# EAGLE design LogicLab1G (EAGLE 7.6.0)
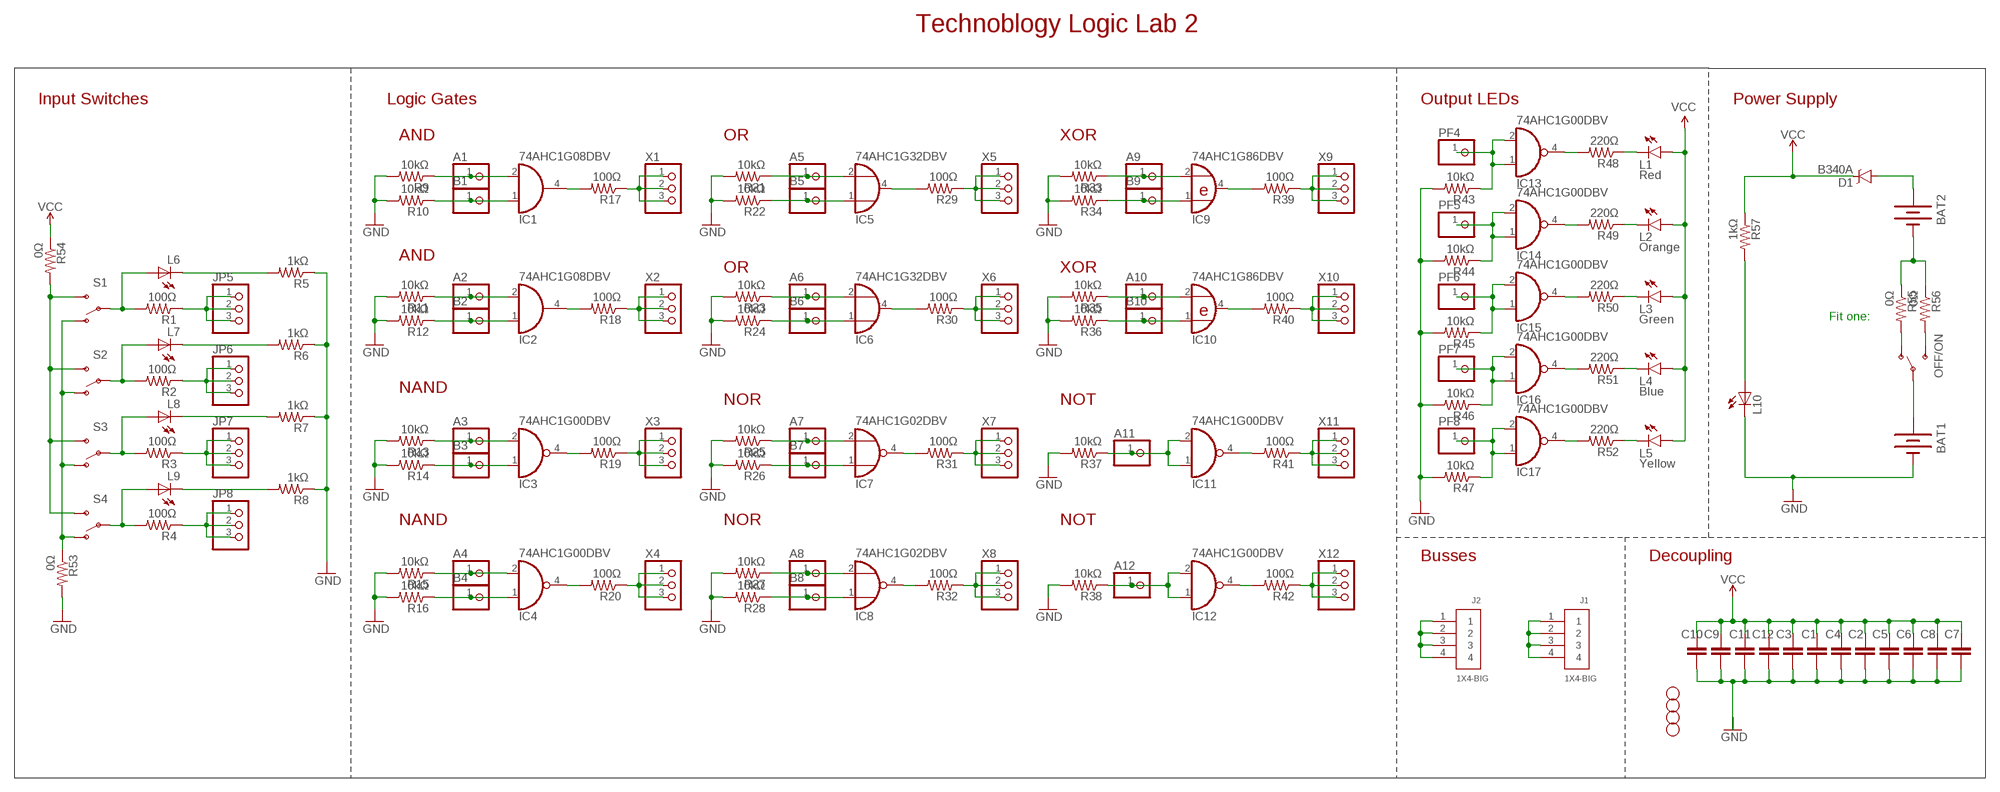
[diagram p0: schematic, sheet 1]

## Parts
A1  PINHD-1X1  [1X01]
A2  PINHD-1X1  [1X01]
A3  PINHD-1X1  [1X01]
A4  PINHD-1X1  [1X01]
A5  PINHD-1X1  [1X01]
A6  PINHD-1X1  [1X01]
A7  PINHD-1X1  [1X01]
A8  PINHD-1X1  [1X01]
A9  PINHD-1X1  [1X01]
A10  PINHD-1X1  [1X01]
A11  PINHD-1X1  [1X01]
A12  PINHD-1X1  [1X01]
B1  PINHD-1X1  [1X01]
B2  PINHD-1X1  [1X01]
B3  PINHD-1X1  [1X01]
B4  PINHD-1X1  [1X01]
B5  PINHD-1X1  [1X01]
B6  PINHD-1X1  [1X01]
B7  PINHD-1X1  [1X01]
B8  PINHD-1X1  [1X01]
B9  PINHD-1X1  [1X01]
B10  PINHD-1X1  [1X01]
BAT1  BATTERYAAA-KIT  [BATTERY-AAA-KIT]
BAT2  BATTERYAAA-KIT  [BATTERY-AAA-KIT]
C1  100n  CAP0805  [0805]
C2  100n  CAP0805  [0805]
C3  100n  CAP0805  [0805]
C4  10uF  CAP0805  [0805]
C5  100n  CAP0805  [0805]
C6  100n  CAP0805  [0805]
C7  100n  CAP0805  [0805]
C8  100n  CAP0805  [0805]
C9  100n  CAP0805  [0805]
C10  100n  CAP0805  [0805]
C11  10uF  CAP0805  [0805]
C12  100n  CAP0805  [0805]
D1  B340A  [SMA-DIODE]
IC1  74AHC1G08DBV  [SOT23-5]
IC2  74AHC1G08DBV  [SOT23-5]
IC3  74AHC1G00DBV  [SOT23-5]
IC4  74AHC1G00DBV  [SOT23-5]
IC5  74AHC1G32DBV  [SOT23-5]
IC6  74AHC1G32DBV  [SOT23-5]
IC7  74AHC1G02DBV  [SOT23-5]
IC8  74AHC1G02DBV  [SOT23-5]
IC9  74AHC1G86DBV  [SOT23-5]
IC10  74AHC1G86DBV  [SOT23-5]
IC11  74AHC1G00DBV  [SOT23-5]
IC12  74AHC1G00DBV  [SOT23-5]
IC13  74AHC1G00DBV  [SOT23-5]
IC14  74AHC1G00DBV  [SOT23-5]
IC15  74AHC1G00DBV  [SOT23-5]
IC16  74AHC1G00DBV  [SOT23-5]
IC17  74AHC1G00DBV  [SOT23-5]
J1  1X4-BIG  [1X04-BIG]
J2  1X4-BIG  [1X04-BIG]
JP1  STAND-OFF  [STAND-OFF]
JP2  STAND-OFF  [STAND-OFF]
JP3  STAND-OFF  [STAND-OFF]
JP4  STAND-OFF  [STAND-OFF]
JP5  PINHD-1X3  [1X03]
JP6  PINHD-1X3  [1X03]
JP7  PINHD-1X3  [1X03]
JP8  PINHD-1X3  [1X03]
L1  Red  LED5MM  [LED5MM]
L2  Orange  LED5MM  [LED5MM]
L3  Green  LED5MM  [LED5MM]
L4  Blue  LED5MM  [LED5MM]
L5  Yellow  LED5MM  [LED5MM]
L6  LEDCHIPLED_0805  [CHIPLED_0805]
L7  LEDCHIPLED_0805  [CHIPLED_0805]
L8  LEDCHIPLED_0805  [CHIPLED_0805]
L9  LEDCHIPLED_0805  [CHIPLED_0805]
L10  LEDCHIPLED_0805  [CHIPLED_0805]
OFF/ON  SWITCH-SPDTKIT  [SWITCH-SPDT_KIT]
PF4  PINHD-1X1  [1X01]
PF5  PINHD-1X1  [1X01]
PF6  PINHD-1X1  [1X01]
PF7  PINHD-1X1  [1X01]
PF8  PINHD-1X1  [1X01]
R1  100Ω  RESISTOR0805-RES  [0805]
R2  100Ω  RESISTOR0805-RES  [0805]
R3  100Ω  RESISTOR0805-RES  [0805]
R4  100Ω  RESISTOR0805-RES  [0805]
R5  1kΩ  RESISTOR0805-RES  [0805]
R6  1kΩ  RESISTOR0805-RES  [0805]
R7  1kΩ  RESISTOR0805-RES  [0805]
R8  1kΩ  RESISTOR0805-RES  [0805]
R9  10kΩ  RESISTOR0805-RES  [0805]
R10  10kΩ  RESISTOR0805-RES  [0805]
R11  10kΩ  RESISTOR0805-RES  [0805]
R12  10kΩ  RESISTOR0805-RES  [0805]
R13  10kΩ  RESISTOR0805-RES  [0805]
R14  10kΩ  RESISTOR0805-RES  [0805]
R15  10kΩ  RESISTOR0805-RES  [0805]
R16  10kΩ  RESISTOR0805-RES  [0805]
R17  100Ω  RESISTOR0805-RES  [0805]
R18  100Ω  RESISTOR0805-RES  [0805]
R19  100Ω  RESISTOR0805-RES  [0805]
R20  100Ω  RESISTOR0805-RES  [0805]
R21  10kΩ  RESISTOR0805-RES  [0805]
R22  10kΩ  RESISTOR0805-RES  [0805]
R23  10kΩ  RESISTOR0805-RES  [0805]
R24  10kΩ  RESISTOR0805-RES  [0805]
R25  10kΩ  RESISTOR0805-RES  [0805]
R26  10kΩ  RESISTOR0805-RES  [0805]
R27  10kΩ  RESISTOR0805-RES  [0805]
R28  10kΩ  RESISTOR0805-RES  [0805]
R29  100Ω  RESISTOR0805-RES  [0805]
R30  100Ω  RESISTOR0805-RES  [0805]
R31  100Ω  RESISTOR0805-RES  [0805]
R32  100Ω  RESISTOR0805-RES  [0805]
R33  10kΩ  RESISTOR0805-RES  [0805]
R34  10kΩ  RESISTOR0805-RES  [0805]
R35  10kΩ  RESISTOR0805-RES  [0805]
R36  10kΩ  RESISTOR0805-RES  [0805]
R37  10kΩ  RESISTOR0805-RES  [0805]
R38  10kΩ  RESISTOR0805-RES  [0805]
R39  100Ω  RESISTOR0805-RES  [0805]
R40  100Ω  RESISTOR0805-RES  [0805]
R41  100Ω  RESISTOR0805-RES  [0805]
R42  100Ω  RESISTOR0805-RES  [0805]
R43  10kΩ  RESISTOR0805-RES  [0805]
R44  10kΩ  RESISTOR0805-RES  [0805]
R45  10kΩ  RESISTOR0805-RES  [0805]
R46  10kΩ  RESISTOR0805-RES  [0805]
R47  10kΩ  RESISTOR0805-RES  [0805]
R48  220Ω  RESISTOR0805-RES  [0805]
R49  220Ω  RESISTOR0805-RES  [0805]
R50  220Ω  RESISTOR0805-RES  [0805]
R51  220Ω  RESISTOR0805-RES  [0805]
R52  220Ω  RESISTOR0805-RES  [0805]
R53  0Ω  RESISTOR0805-RES  [0805]
R54  0Ω  RESISTOR0805-RES  [0805]
R55  0Ω  RESISTOR0805-RES  [0805]
R56  0Ω  RESISTOR0805-RES  [0805]
R57  1kΩ  RESISTOR0805-RES  [0805]
S1  SWITCH-SPDTKIT  [SWITCH-SPDT_KIT]
S2  SWITCH-SPDTKIT  [SWITCH-SPDT_KIT]
S3  SWITCH-SPDTKIT  [SWITCH-SPDT_KIT]
S4  SWITCH-SPDTKIT  [SWITCH-SPDT_KIT]
X1  PINHD-1X3  [1X03]
X2  PINHD-1X3  [1X03]
X3  PINHD-1X3  [1X03]
X4  PINHD-1X3  [1X03]
X5  PINHD-1X3  [1X03]
X6  PINHD-1X3  [1X03]
X7  PINHD-1X3  [1X03]
X8  PINHD-1X3  [1X03]
X9  PINHD-1X3  [1X03]
X10  PINHD-1X3  [1X03]
X11  PINHD-1X3  [1X03]
X12  PINHD-1X3  [1X03]

## Nets
BOTTOMS: R53.1 S1.1(O) S2.1(O) S3.1(O) S4.1(O)
GND: BAT1.GND@1(-) C1.2 C2.2 C3.2 C4.2 C5.2 C6.2 C7.2 C8.2 C9.2 C10.2 C11.2 C12.2 L10.C R5.1 R6.1 R7.1 R8.1 R9.2 R10.2 R11.2 R12.2 R13.2 R14.2 R15.2 R16.2 R21.2 R22.2 R23.2 R24.2 R25.2 R26.2 R27.2 R28.2 R33.2 R34.2 R35.2 R36.2 R37.2 R38.2 R43.2 R44.2 R45.2 R46.2 R47.2 R53.2
N$1: A9.1 IC9.2(I1) R33.1
N$6: R30.1 X6.1 X6.2 X6.3
N$7: R29.1 X5.1 X5.2 X5.3
N$8: B4.1 IC4.1(I0) R16.1
N$9: IC13.4(O) R48.2
N$10: IC14.4(O) R49.2
N$11: IC15.4(O) R50.2
N$12: BAT1.PWR@1(+) OFF/ON.2(P)
N$13: B10.1 IC10.1(I0) R36.1
N$14: IC16.4(O) R51.2
N$15: A4.1 IC4.2(I1) R15.1
N$16: IC17.4(O) R52.2
N$17: BAT2.PWR@1(+) D1.A
N$18: R39.1 X9.1 X9.2 X9.3
N$19: IC2.4(O) R18.2
N$20: OFF/ON.1(O) R55.2
N$21: R40.1 X10.1 X10.2 X10.3
N$22: A1.1 IC1.2(I1) R9.1
N$23: IC5.4(O) R29.2
N$24: BAT2.GND@1(-) R55.1 R56.1
N$25: L1.K(C) R48.1
N$26: B3.1 IC3.1(I0) R14.1
N$27: B1.1 IC1.1(I0) R10.1
N$28: B7.1 IC7.1(I0) R26.1
N$29: B9.1 IC9.1(I0) R34.1
N$30: R17.1 X1.1 X1.2 X1.3
N$31: R41.1 X11.1 X11.2 X11.3
N$32: OFF/ON.3(S) R56.2
N$33: R18.1 X2.1 X2.2 X2.3
N$34: B2.1 IC2.1(I0) R12.1
N$35: A10.1 IC10.2(I1) R35.1
N$36: R42.1 X12.1 X12.2 X12.3
N$38: L6.A R1.2 S1.2(P)
N$39: R19.1 X3.1 X3.2 X3.3
N$40: A8.1 IC8.2(I1) R27.1
N$41: R31.1 X7.1 X7.2 X7.3
N$42: B5.1 IC5.1(I0) R22.1
N$43: L7.A R2.2 S2.2(P)
N$44: A5.1 IC5.2(I1) R21.1
N$45: IC3.4(O) R19.2
N$46: IC9.4(O) R39.2
N$47: IC10.4(O) R40.2
N$48: IC12.4(O) R42.2
N$49: IC11.4(O) R41.2
N$50: R32.1 X8.1 X8.2 X8.3
N$51: A11.1 IC11.1(I0) IC11.2(I1) R37.1
N$52: A12.1 IC12.1(I0) IC12.2(I1) R38.1
N$53: L2.K(C) R49.1
N$54: IC6.4(O) R30.2
N$56: L8.A R3.2 S3.2(P)
N$57: L9.A R4.2 S4.2(P)
N$58: IC4.4(O) R20.2
N$61: R20.1 X4.1 X4.2 X4.3
N$62: L3.K(C) R50.1
N$63: L4.K(C) R51.1
N$64: L5.K(C) R52.1
N$65: IC13.1(I0) IC13.2(I1) PF4.1 R43.1
N$66: IC14.1(I0) IC14.2(I1) PF5.1 R44.1
N$68: JP8.1 JP8.2 JP8.3 R4.1
N$69: JP7.1 JP7.2 JP7.3 R3.1
N$70: L10.A R57.2
N$71: J2.1 J2.2 J2.3 J2.4
N$72: JP6.1 JP6.2 JP6.3 R2.1
N$73: L9.C R8.2
N$74: L8.C R7.2
N$75: JP5.1 JP5.2 JP5.3 R1.1
N$76: L6.C R5.2
N$77: L7.C R6.2
N$78: B8.1 IC8.1(I0) R28.1
N$79: J1.1 J1.2 J1.3 J1.4
N$82: A6.1 IC6.2(I1) R23.1
N$85: IC15.1(I0) IC15.2(I1) PF6.1 R45.1
N$86: B6.1 IC6.1(I0) R24.1
N$87: A7.1 IC7.2(I1) R25.1
N$89: A3.1 IC3.2(I1) R13.1
N$90: A2.1 IC2.2(I1) R11.1
N$97: IC8.4(O) R32.2
N$98: IC7.4(O) R31.2
N$99: IC16.1(I0) IC16.2(I1) PF7.1 R46.1
N$101: IC17.1(I0) IC17.2(I1) PF8.1 R47.1
N$102: IC1.4(O) R17.2
TOPS: R54.2 S1.3(S) S2.3(S) S3.3(S) S4.3(S)
VCC: C1.1 C2.1 C3.1 C4.1 C5.1 C6.1 C7.1 C8.1 C9.1 C10.1 C11.1 C12.1 D1.C L1.A L2.A L3.A L4.A L5.A R54.1 R57.1

## Notes on the sheet
- Technoblogy Logic Lab 2
- Input Switches | Logic Gates | Output LEDs | Power Supply
- AND | OR | XOR
- AND
- OR | XOR
- Fit one:
- NAND
- NOR | NOT
- NAND | NOR | NOT
- Busses | Decoupling

## Power pins joined to a net without a drawn wire
GND: IC1.3(GND) IC2.3(GND) IC3.3(GND) IC4.3(GND) IC5.3(GND) IC6.3(GND) IC7.3(GND) IC8.3(GND) IC9.3(GND) IC10.3(GND) IC11.3(GND) IC12.3(GND) IC13.3(GND) IC14.3(GND) IC15.3(GND) IC16.3(GND) IC17.3(GND)
VCC: IC1.5(VCC) IC2.5(VCC) IC3.5(VCC) IC4.5(VCC) IC5.5(VCC) IC6.5(VCC) IC7.5(VCC) IC8.5(VCC) IC9.5(VCC) IC10.5(VCC) IC11.5(VCC) IC12.5(VCC) IC13.5(VCC) IC14.5(VCC) IC15.5(VCC) IC16.5(VCC) IC17.5(VCC)

## Library data of the parts
A1-A12 B1-B10 PF4-PF8 = adafruit:PINHD-1X1: Pin header 1x1 for 0.1" spacing With round pins
BAT1 BAT2 = SparkFun-Electromechanical:BATTERY: Battery Holders Various common sizes : AA, AAA, 18650 (PRT-12895), 20mm coin cell and 12mm coin cell. 20MM_4LEGS, BATT-10373; PROD_ID: BATT-08571
C1-C12 = SparkFun-Capacitors:CAP: Capacitor Standard 0603 ceramic capacitor, and 0.1" leaded capacitor.
D1 = SparkFun-DiscreteSemi:B340A: Schottky Diode 3A-40V; PROD_ID: DIO-09886; VALUE: BA340A
IC1 IC2 = 74xx-little-de:74*1G08: 2-input AND gate
IC3 IC4 IC11-IC17 = 74xx-little-de:74*1G00: 2-input NAND gate
IC5 IC6 = 74xx-little-de:74*1G32: 2-input OR gate
IC7 IC8 = 74xx-little-de:74*1G02: 2-input NOR gate
IC9 IC10 = 74xx-little-de:74*1G86: 2-input EXCLUSIV-OR gate
J1 J2 = adafruit:1X4: 4-pin connector
JP1-JP4 = SparkFun:STAND-OFF: Stand Off This is the mechanical footprint for a #4 phillips button head screw. Use the keepout ring to avoid running the screw head into surrounding components. SKU : PRT-00447
JP5-JP8 X1-X12 = adafruit:PINHD-1X3: PIN HEADER
L1-L5 = SparkFun-LED:LED: LEDs Standard schematic elements and footprints for 5mm, 3mm, 1206, and 0603 sized LEDs. 5mm - Spark Fun Electronics SKU : COM-00529 (and others)
L6-L10 = adafruit:LED: LED OSRAM: - CHIPLED LG R971, LG N971, LY N971, LG Q971, LY Q971, LO R971, LY R971 LH N974, LH R974 LS Q976, LO Q976, LY Q976 LO Q996 - Hyper CHIPLED LW Q18S LB Q993, LB Q99A, LB R99A - SideLED LS A670, LO A670, LY A670, LG A670, LP A670 LB A673, LV A673, LT A673, LW A673 LH A674 LY A675 LS A676, LA A676, LO A676, LY A676, LW A676 LS A679, LY A679, LG A679 - Hyper Micro SIDELED® LS Y876, LA Y876, LO Y876, LY Y876 LT Y87S - SmartLED LW L88C, LW L88S LB L89C, LB L89S, LG L890 LS L89K, LO L89K, LY L89K LS L896, LA L896, LO L896, LY L896 - TOPLED LS T670, LO T670, LY T670, LG T670, LP T670 LSG T670, LSP T670, LSY T670, LOP T670, LYG T670 LG T671, LOG T671, LSG T671 LB T673, LV T673, LT T673, LW T673 LH T674 LS T676, LA T676, LO T676, LY T676, LB T676, LH T676, LSB T676, LW T676 LB T67C, LV T67C, LT T67C, LS T67K, LO T67K, LY T67K, LW E67C LS E67B, LA E67B, LO E67B, LY E67B, LB E67C, LV E67C, LT E67C LW T67C LS T679, LY T679, LG T679 LS T770, LO T770, LY T770, LG T770, LP T770 LB T773, LV T773, LT T773, LW T773 LH T774 LS E675, LA E675, LY E675, LS T675 LS T776, LA T776, LO T776, LY T776, LB T776 LHGB T686 LT T68C, LB T68C - Hyper Mini TOPLED® LB M676 - Mini TOPLED Santana® LG M470 LS M47K, LO M47K, LY M47K Source: http://www.osram.convergy.de/
OFF/ON S1-S4 = technoblogy:SWITCH-SPDT: SPDT Switch Simple slide switch, Spark Fun Electronics SKU : COM-00102 DPDT SMT slide switch, AYZ0202, SWCH-08179; PROD_ID: SWCH-08261
R1-R57 = SparkFun-Resistors:RESISTOR: Resistor Basic schematic elements and footprints for 0603, 1206, and PTH resistors.

## Net classes
0 default: width 0.152 mm, drill 0.305 mm, clearance 0.152 mm

## Board
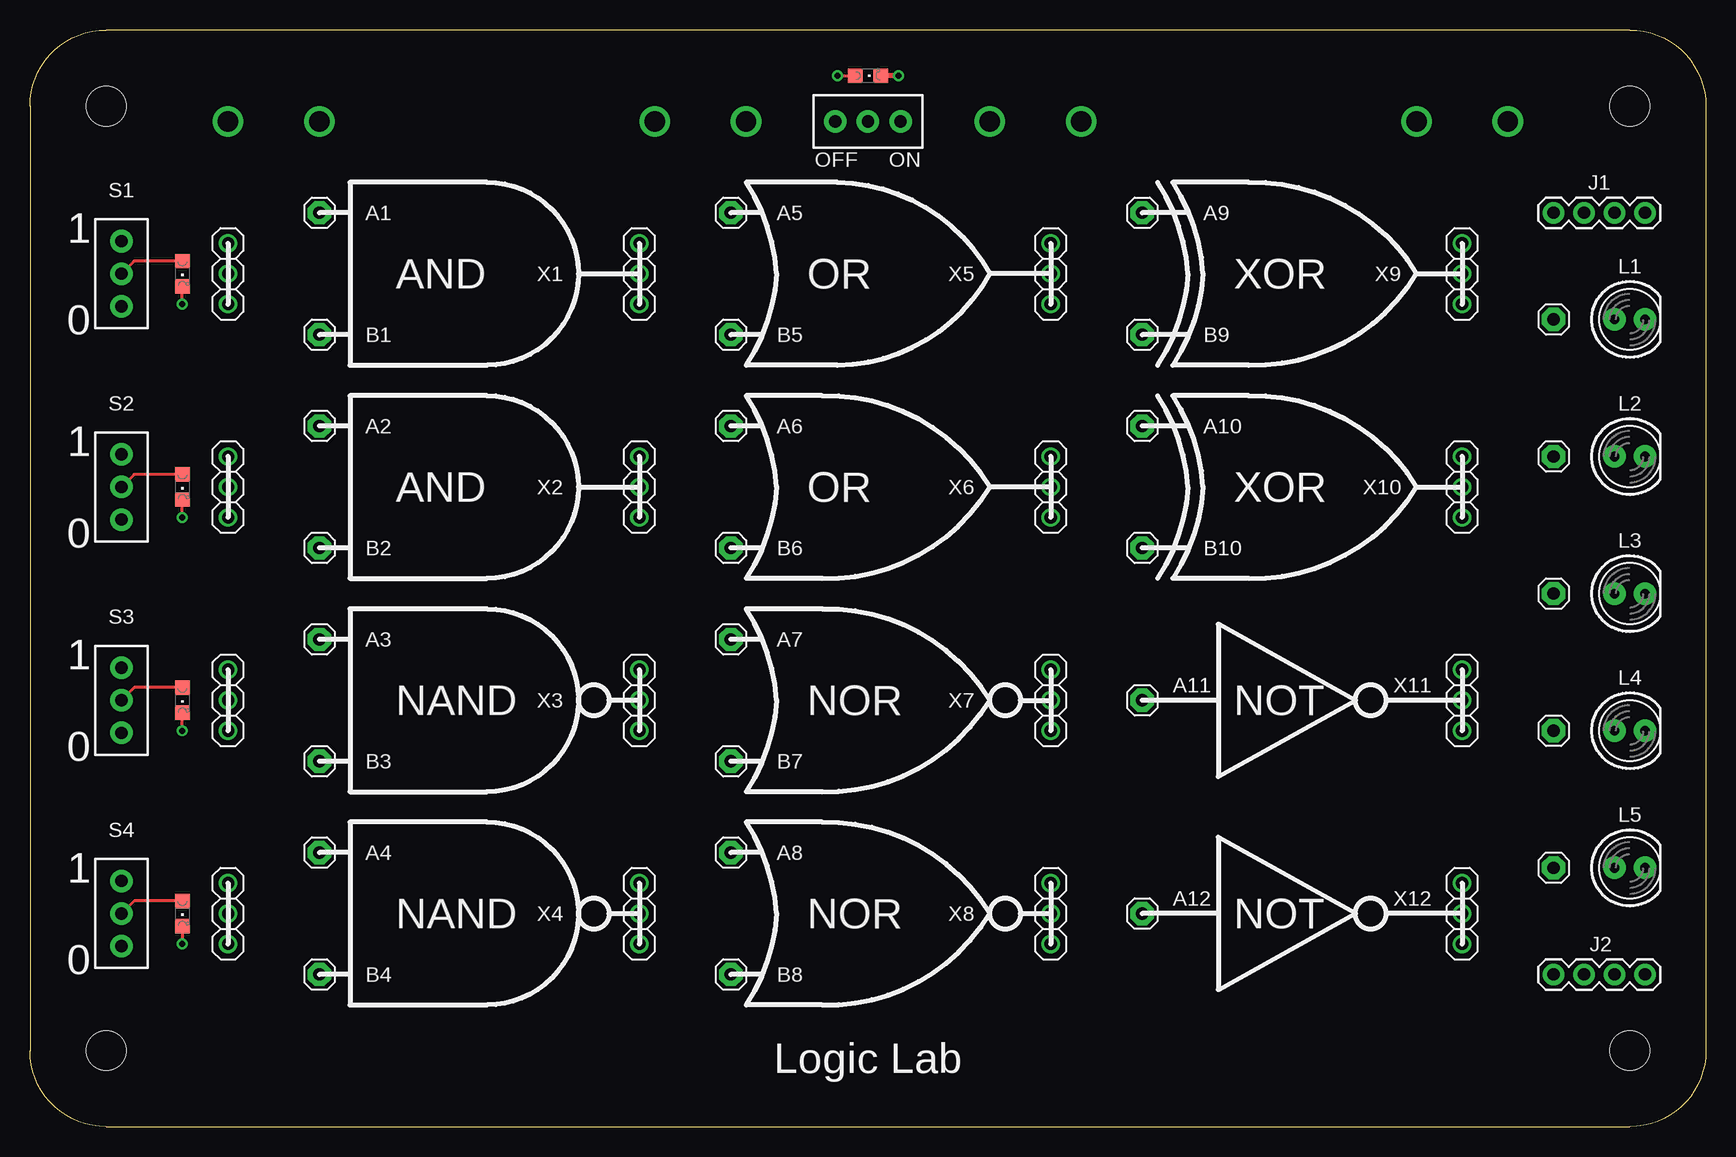
[diagram p1: board, top side]
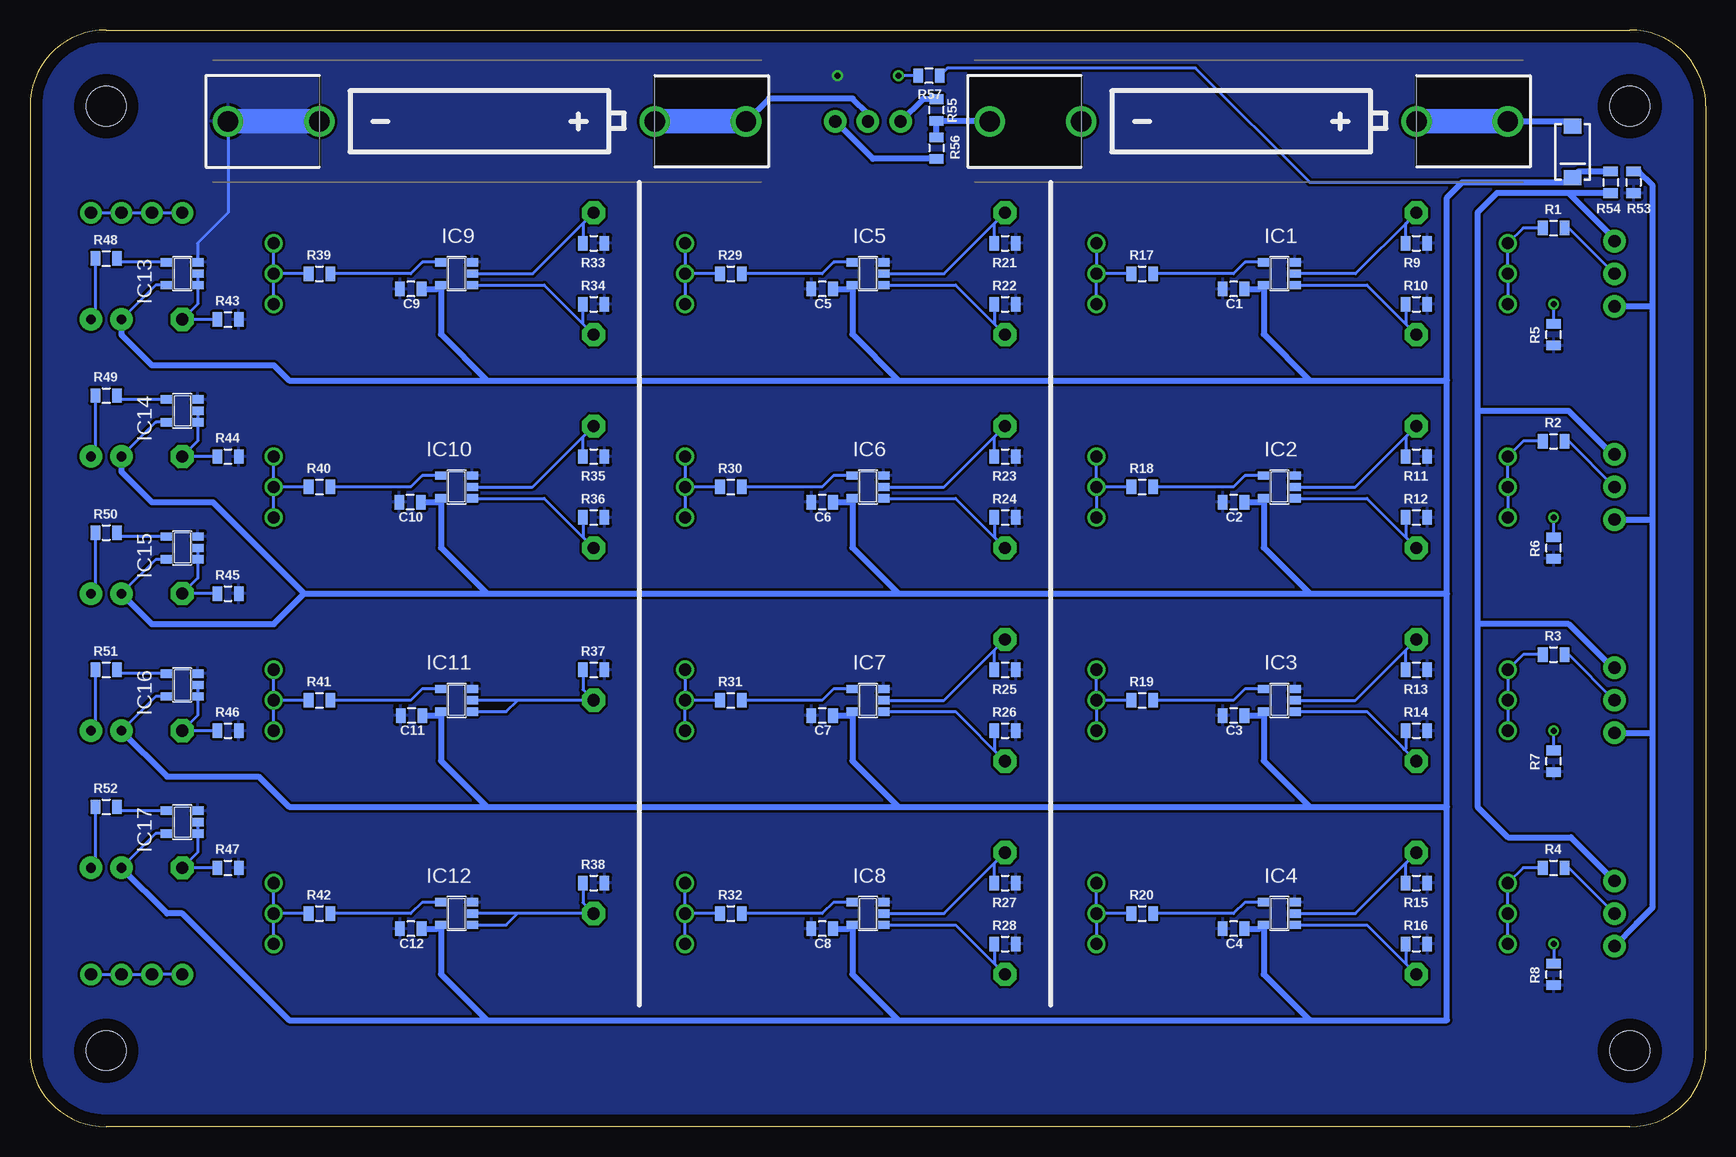
[diagram p2: board, bottom side, seen from below]

Size 139.7 x 91.44 mm. Coordinates in mm from the lower left corner, seen from the top.
Outline: 6.35,0 133.35,0 arc90 139.7,6.35 139.7,85.09 arc90 133.35,91.44 6.35,91.44 arc90 0,85.09 0,6.35 arc90 6.35,0
Copper layers (1*16): Top 0.035mm / dielectric 1.5mm / Bottom 0.035mm
Design rules "default *": minimum track width 10mil, minimum drill 24mil, track to track 8mil, track to pad 8mil, pad to pad 8mil, via to via 8mil, smd to smd 8mil, copper to edge 40mil, drill to drill 8mil, minimum pad ring 10mil, minimum via ring 8mil, stop-mask expansion 4mil, vias tented up to drill 20mil, thermal gap 10mil

### Footprints (pad centres in the part's own frame; a part is rotated, then mirrored left to right if it is on the bottom)
1X01 = drill 1.016 pad 1.93 octagon: 1 0,0
BATTERY-AAA-KIT = drill 1.702: GND@1 21.59,0; GND@2 13.97,0; PWR@1 -21.59,0; PWR@2 -13.97,0
0805 = smd 0.8 x 1.2: 1 -0.9,0; 2 0.9,0
SMA-DIODE = smd 1.27 x 1.47: A -2.15,0; C 2.15,0
SOT23-5 = smd 0.69 x 0.99: 1 -0.95,-1.29; 2 0,-1.29; 3 0.95,-1.29; 4 0.95,1.3; 5 -0.95,1.3
1X04-BIG = drill 1.016 pad 1.778: 1 0,0; 2 2.54,0; 3 5.08,0; 4 7.62,0
STAND-OFF = hole 3.302: 0,0
1X03 = drill 1.016: 1 -2.54,0; 2 0,0; 3 2.54,0
LED5MM = drill 0.813 pad 1.88: A -1.27,0; K 1.27,0
CHIPLED_0805 = smd 1.2 x 1.2: A 0,-1.05; C 0,1.05
SWITCH-SPDT_KIT = drill 1.016 pad 1.88: 1 0,2.718; 2 0,0; 3 0,-2.718

### Placement (x,y rotation side)
A1  24.13,76.2 0 top
A2  24.13,58.42 0 top
A3  24.13,40.64 0 top
A4  24.13,22.86 0 top
A5  58.42,76.2 0 top
A6  58.42,58.42 0 top
A7  58.42,40.64 0 top
A8  58.42,22.86 0 top
A9  92.71,76.2 0 top
A10  92.71,58.42 0 top
A11  92.71,35.56 0 top
A12  92.71,17.78 0 top
B1  24.13,66.04 0 top
B2  24.13,48.26 0 top
B3  24.13,30.48 0 top
B4  24.13,12.7 0 top
B5  58.42,66.04 0 top
B6  58.42,48.26 0 top
B7  58.42,30.48 0 top
B8  58.42,12.7 0 top
B9  92.71,66.04 0 top
B10  92.71,48.26 0 top
BAT1  101.6,83.82 180 bottom
BAT2  38.1,83.82 180 bottom
C1  39.37,69.85 180 bottom
C2  39.37,52.07 180 bottom
C3  39.37,34.29 180 bottom
C4  39.37,16.51 180 bottom
C5  73.66,69.85 180 bottom
C6  73.66,52.07 180 bottom
C7  73.66,34.29 180 bottom
C8  73.66,16.51 180 bottom
C9  107.95,69.85 180 bottom
C10  108.01,52.07 180 bottom
C11  107.89,34.29 180 bottom
C12  107.95,16.51 180 bottom
D1  11.11,81.28 270 bottom
IC1  35.56,71.12 90 bottom
IC2  35.56,53.34 90 bottom
IC3  35.56,35.56 90 bottom
IC4  35.56,17.78 90 bottom
IC5  69.85,71.12 90 bottom
IC6  69.85,53.34 90 bottom
IC7  69.85,35.56 90 bottom
IC8  69.85,17.78 90 bottom
IC9  104.14,71.12 90 bottom
IC10  104.14,53.34 90 bottom
IC11  104.14,35.56 90 bottom
IC12  104.14,17.78 90 bottom
IC13  127,71.12 90 bottom
IC14  127,59.69 90 bottom
IC15  127,48.26 90 bottom
IC16  127,36.83 90 bottom
IC17  127,25.4 90 bottom
J1  127,76.2 0 top
J2  127,12.7 0 top
JP1  6.35,85.09 0 top
JP2  6.35,6.35 0 top
JP3  133.35,6.35 0 top
JP4  133.35,85.09 0 top
JP5  16.51,71.12 90 top
JP6  16.51,53.34 90 top
JP7  16.51,35.56 90 top
JP8  16.51,17.78 90 top
L1  133.35,67.31 0 top
L2  133.35,55.88 0 top
L3  133.35,44.45 0 top
L4  133.35,33.02 0 top
L5  133.35,21.59 0 top
L6  12.7,71.12 180 top
L7  12.7,53.34 180 top
L8  12.7,35.56 180 top
L9  12.7,17.78 180 top
L10  69.85,87.63 270 top
OFF/ON  69.85,83.82 90 top
PF4  127,67.31 0 top
PF5  127,55.88 0 top
PF6  127,44.45 0 top
PF7  127,33.02 0 top
PF8  127,21.59 0 top
R1  12.7,74.93 0 bottom
R2  12.7,57.15 0 bottom
R3  12.7,39.37 0 bottom
R4  12.7,21.59 0 bottom
R5  12.7,66.04 90 bottom
R6  12.7,48.26 90 bottom
R7  12.7,30.48 90 bottom
R8  12.7,12.7 90 bottom
R9  24.13,73.66 0 bottom
R10  24.13,68.58 0 bottom
R11  24.13,55.88 0 bottom
R12  24.13,50.8 0 bottom
R13  24.13,38.1 0 bottom
R14  24.13,33.02 0 bottom
R15  24.13,20.32 0 bottom
R16  24.13,15.24 0 bottom
R17  46.99,71.12 0 bottom
R18  46.99,53.34 0 bottom
R19  46.99,35.56 0 bottom
R20  46.99,17.78 0 bottom
R21  58.42,73.66 0 bottom
R22  58.42,68.58 0 bottom
R23  58.42,55.88 0 bottom
R24  58.42,50.8 0 bottom
R25  58.42,38.1 0 bottom
R26  58.42,33.02 0 bottom
R27  58.42,20.32 0 bottom
R28  58.42,15.24 0 bottom
R29  81.28,71.12 0 bottom
R30  81.28,53.34 0 bottom
R31  81.28,35.56 0 bottom
R32  81.28,17.78 0 bottom
R33  92.71,73.66 0 bottom
R34  92.71,68.58 0 bottom
R35  92.71,55.88 0 bottom
R36  92.71,50.8 0 bottom
R37  92.71,38.1 0 bottom
R38  92.71,20.32 0 bottom
R39  115.57,71.12 0 bottom
R40  115.57,53.34 0 bottom
R41  115.57,35.56 0 bottom
R42  115.57,17.78 0 bottom
R43  123.19,67.31 0 bottom
R44  123.19,55.88 0 bottom
R45  123.19,44.45 0 bottom
R46  123.19,33.02 0 bottom
R47  123.19,21.59 0 bottom
R48  133.35,72.39 0 bottom
R49  133.35,60.96 0 bottom
R50  133.35,49.53 0 bottom
R51  133.35,38.1 0 bottom
R52  133.35,26.67 0 bottom
R53  6.03,78.74 270 bottom
R54  7.94,78.74 270 bottom
R55  64.14,84.77 90 bottom
R56  64.14,81.6 270 bottom
R57  64.77,87.63 180 bottom
S1  7.62,71.12 180 top
S2  7.62,53.34 180 top
S3  7.62,35.56 180 top
S4  7.62,17.78 180 top
X1  50.8,71.12 90 top
X2  50.8,53.34 90 top
X3  50.8,35.56 90 top
X4  50.8,17.78 90 top
X5  85.09,71.12 90 top
X6  85.09,53.34 90 top
X7  85.09,35.56 90 top
X8  85.09,17.78 90 top
X9  119.38,71.12 90 top
X10  119.38,53.34 90 top
X11  119.38,35.56 90 top
X12  119.38,17.78 90 top

### Tracks (layer width: path | path; a pad name or v marks a point on that pad's centre or on a via)
BOTTOMS
  Bottom 0.508: S4.1 5.77,16.97 4.45,18.29 4.45,33.02 | 4.45,33.02 4.45,50.8 | 4.45,50.8 4.45,68.58 | 4.45,68.58 4.45,78.49 5.59,79.63 6.34,79.63 R53.1 | S1.1 4.62,68.4 4.45,68.58 | S2.1 4.62,50.62 4.45,50.8 | S3.1 4.62,32.84 4.45,33.02
GND  (via drill 0.5)
  Top 0.406: v72.39,87.63 L10.C
  Bottom 0.254: BAT1.GND@1 123.19,76.2 125.73,73.66 125.73,72.09 IC13.3
  Bottom 2.032: 115.57,83.82 BAT1.GND@1
  pour Bottom: 0,91.44 139.7,91.44 139.7,0 0,0
N$1
  Bottom 0.254: R33.1 93.61,75.3 A9.1 97.79,71.12 IC9.2
N$6
  Bottom 0.254: X6.3 X6.2 | X6.2 X6.1 | R30.1 X6.2
N$7
  Bottom 0.254: X5.3 X5.2 | X5.2 X5.1 | R29.1 X5.2
N$8
  Bottom 0.254: R16.1 25.03,13.6 B4.1 28.26,16.83 IC4.1
N$9
  Bottom 0.254: IC13.4 132.13,72.07 R48.2
N$10
  Bottom 0.254: IC14.4 132.13,60.64 R49.2
N$11
  Bottom 0.254: IC15.4 132.13,49.21 R50.2
N$12
  Bottom 0.508: OFF/ON.2 69.85,84.45 71.12,85.72 78.11,85.72 BAT1.PWR@1
N$13
  Bottom 0.254: R36.1 93.61,49.16 B10.1 96.84,52.39 IC10.1
N$14
  Bottom 0.254: IC16.4 132.13,37.78 R51.2
N$15
  Bottom 0.254: R15.1 25.03,21.96 A4.1 29.21,17.78 IC4.2
N$16
  Bottom 0.254: IC17.4 132.13,26.35 R52.2
N$17
  Bottom 0.508: BAT2.PWR@1 11.5,83.82 D1.A
  Bottom 1.016: BAT2.PWR@1
N$18
  Bottom 0.254: X9.1 X9.2 | X9.2 X9.3 | R39.1 X9.2
N$19
  Bottom 0.254: IC2.4 38.42,54.29 39.37,53.34 R18.2
N$20
  Bottom 0.508: R55.2 65.28,85.67 OFF/ON.1
N$21
  Bottom 0.254: X10.1 X10.2 | X10.2 X10.3 | R40.1 X10.2
N$22
  Bottom 0.254: A1.1 24.77,75.56 | R9.1 25.03,75.31 24.77,75.56 | 24.77,75.56 29.21,71.12 IC1.2
N$23
  Bottom 0.254: IC5.4 72.71,72.07 73.66,71.12 R29.2
N$24
  Bottom 0.508: R56.1 R55.1 64.14,83.82 BAT2.GND@1
N$25
  Bottom 0.254: R48.1 134.25,67.68 L1.K
N$26
  Bottom 0.254: 25.08,31.43 25.4,31.75 28.26,34.61 IC3.1 | 25.08,31.43 B3.1 | R14.1 25.03,31.48 25.08,31.43
N$27
  Bottom 0.254: R10.1 25.03,66.94 B1.1 28.26,70.17 IC1.1
N$28
  Bottom 0.254: R26.1 59.32,31.38 B7.1 62.55,34.61 IC7.1
N$29
  Bottom 0.254: R34.1 93.61,66.94 B9.1 96.84,70.17 IC9.1
N$30
  Bottom 0.254: R17.1 X1.2 | X1.3 X1.2 | X1.1 X1.2
N$31
  Bottom 0.254: X11.1 X11.2 | X11.2 X11.3 | R41.1 X11.2
N$32
  Bottom 0.508: R56.2 69.44,80.7 OFF/ON.3
N$33
  Bottom 0.254: R18.1 X2.2 | X2.2 X2.3 | X2.2 X2.1
N$34
  Bottom 0.254: R12.1 25.03,49.16 B2.1 28.26,52.39 IC2.1
N$35
  Bottom 0.254: R35.1 93.61,57.52 A10.1 97.79,53.34 IC10.2
N$36
  Bottom 0.254: X12.1 X12.2 | X12.2 X12.3 | R42.1 X12.2
N$38
  Top 0.254: L6.A 8.67,72.17 S1.2
  Bottom 0.254: R1.2 11.43,74.93 S1.2
N$39
  Bottom 0.254: R19.1 X3.2 | X3.2 X3.3 | X3.2 X3.1
N$40
  Bottom 0.254: R27.1 59.32,21.96 A8.1 63.5,17.78 IC8.2
N$41
  Bottom 0.254: X7.3 X7.2 | X7.1 X7.2 | R31.1 X7.2
N$42
  Bottom 0.254: B5.1 58.67,66.04 | R22.1 59.32,66.94 B5.1 | IC5.1 62.55,70.17 B5.1
N$43
  Top 0.254: L7.A 8.67,54.39 S2.2
  Bottom 0.254: R2.2 11.43,57.15 S2.2
N$44
  Bottom 0.254: R21.1 59.32,75.3 A5.1 63.5,71.12 IC5.2
N$45
  Bottom 0.254: R19.2 39.37,35.56 38.42,36.51 IC3.4
N$46
  Bottom 0.254: IC9.4 107,72.07 107.95,71.12 R39.2
N$47
  Bottom 0.254: IC10.4 107,54.29 107.95,53.34 R40.2
N$48
  Bottom 0.254: IC12.4 107,18.73 107.95,17.78 R42.2
N$49
  Bottom 0.254: IC11.4 107,36.51 107.95,35.56 R41.2
N$50
  Bottom 0.254: X8.1 X8.2 | X8.2 X8.3 | R32.1 X8.2
N$51
  Bottom 0.254: R37.1 93.61,36.46 A11.1 99.06,35.56 | 99.06,35.56 IC11.2 | IC11.1 100.01,34.61 99.06,35.56
N$52
  Bottom 0.254: R38.1 93.61,18.68 A12.1 99.06,17.78 | 99.06,17.78 IC12.2 | IC12.1 100.01,16.83 99.06,17.78
N$53
  Bottom 0.254: R49.1 134.25,56.25 L2.K
N$54
  Bottom 0.254: IC6.4 72.71,54.29 73.66,53.34 R30.2
N$56
  Top 0.254: L8.A 8.67,36.61 S3.2
  Bottom 0.254: R3.2 11.43,39.37 S3.2
N$57
  Top 0.254: L9.A 8.67,18.83 S4.2
  Bottom 0.254: S4.2 11.43,21.59 R4.2
N$58
  Bottom 0.254: IC4.4 38.42,18.73 39.37,17.78 R20.2
N$61
  Bottom 0.254: R20.1 X4.2 | X4.2 X4.3 | X4.2 X4.1
N$62
  Bottom 0.254: R50.1 134.25,44.08 L3.K
N$63
  Bottom 0.254: R51.1 134.25,33.39 L4.K
N$64
  Bottom 0.254: R52.1 134.25,21.96 L5.K
N$65
  Bottom 0.254: R43.1 PF4.1 125.71,68.6 IC13.1 IC13.2
N$66
  Bottom 0.254: R44.1 PF5.1 125.71,57.17 IC14.1 IC14.2
N$67
  Bottom 2.032: 16.51,83.82 24.13,83.82
N$68
  Bottom 0.254: JP8.1 JP8.2 JP8.3 15.24,21.59 R4.1
N$69
  Bottom 0.254: JP7.1 JP7.2 JP7.3 15.24,39.37 R3.1
N$70  (via drill 0.5)
  Top 0.254: v67.31,87.63 L10.A
  Bottom 0.254: R57.2 v67.31,87.63
N$71
  Bottom 0.254: J2.1 J2.2 J2.3 J2.4
N$72
  Bottom 0.254: JP6.1 JP6.2 JP6.3 15.24,57.15 R2.1
N$73  (via drill 0.5)
  Top 0.254: L9.C v12.7,15.24
  Bottom 0.254: v12.7,15.24 R8.2
N$74  (via drill 0.5)
  Top 0.254: v12.7,33.02 L8.C
  Bottom 0.254: R7.2 v12.7,33.02
N$75
  Bottom 0.254: JP5.1 JP5.2 JP5.3 15.24,74.93 R1.1
N$76  (via drill 0.5)
  Top 0.254: v12.7,68.58 L6.C
  Bottom 0.254: R5.2 v12.7,68.58
N$77  (via drill 0.5)
  Top 0.254: v12.7,50.8 L7.C
  Bottom 0.254: R6.2 v12.7,50.8
N$78
  Bottom 0.254: R28.1 59.32,13.6 B8.1 62.55,16.83 IC8.1
N$79
  Bottom 0.254: J1.4 J1.3 J1.2 J1.1
N$80
  Bottom 2.032: 80.01,83.82 87.63,83.82
N$82
  Bottom 0.254: R23.1 59.32,57.52 A6.1 | 58.93,58.42 A6.1 | IC6.2 63.5,53.34 A6.1
N$85
  Bottom 0.254: R45.1 PF6.1 125.71,45.74 IC15.1 IC15.2
N$86
  Bottom 0.254: R24.1 59.32,49.16 B6.1 62.55,52.39 IC6.1
N$87
  Bottom 0.254: R25.1 59.32,39.74 A7.1 63.5,35.56 IC7.2
N$89
  Bottom 0.254: R13.1 25.03,39.74 A3.1 29.21,35.56 IC3.2
N$90
  Bottom 0.254: R11.1 25.03,57.52 A2.1 29.21,53.34 IC2.2
N$97
  Bottom 0.254: IC8.4 72.71,18.73 73.66,17.78 R32.2
N$98
  Bottom 0.254: IC7.4 72.71,36.51 73.66,35.56 R31.2
N$99
  Bottom 0.254: R46.1 PF7.1 125.71,34.31 IC16.1 IC16.2
N$101
  Bottom 0.254: IC17.2 IC17.1 125.71,22.88 PF8.1 R47.1
N$102
  Bottom 0.254: IC1.4 38.42,72.07 39.37,71.12 R17.2
TOPS
  Bottom 0.508: R54.2 11.43,77.84 | 11.43,77.84 17.41,77.84 19.05,76.2 19.05,59.69 | 19.05,59.69 19.05,41.91 | 19.05,41.91 19.05,26.67 16.51,24.13 11.25,24.13 S4.3 | S1.3 7.62,74.03 11.43,77.84 | S2.3 7.8,56.06 11.43,59.69 19.05,59.69 | S3.3 7.8,38.28 11.43,41.91 19.05,41.91
VCC
  Bottom 0.254: IC16.5 129.22,35.88 L4.A | IC17.5 129.22,24.45 L5.A | IC15.5 129.22,47.31 L3.A | IC14.5 129.22,58.74 L2.A | IC13.5 129.22,70.17 L1.A | 20.32,78.74 33.02,78.74 42.55,88.27 63.23,88.27 R57.1
  Bottom 0.508: 33.02,62.23 21.59,62.23 | 67.31,62.23 33.02,62.23 | 33.02,26.67 21.59,26.67 | 67.31,8.89 33.02,8.89 | 33.02,8.89 21.59,8.89 21.59,26.67 | 101.6,8.89 118.11,8.89 127,17.78 128.27,17.78 L5.A | 101.6,8.89 67.31,8.89 | 101.6,26.67 105.44,30.51 IC11.5 105.76,34.29 C11.1 | 101.6,26.67 67.31,26.67 | 67.31,26.67 33.02,26.67 | 101.6,62.23 118.11,62.23 119.38,63.5 129.54,63.5 132.08,66.04 L1.A | 101.6,62.23 67.31,62.23 | 21.59,62.23 21.59,77.47 20.32,78.74 11.5,78.74 D1.C 10.6,79.64 R54.1 | 21.59,26.67 21.59,44.45 | 21.59,44.45 21.59,62.23 | 36.86,12.73 IC4.5 37.18,16.51 C4.1 | 36.86,12.73 33.02,8.89 | 33.02,26.67 36.86,30.51 IC3.5 37.18,34.29 C3.1 | L2.A 132.08,54.61 129.54,52.07 124.46,52.07 116.84,44.45 | L3.A 129.54,41.91 119.38,41.91 116.84,44.45 | L4.A 128.27,29.21 120.65,29.21 118.11,26.67 101.6,26.67 | 101.6,8.89 105.44,12.73 IC12.5 105.76,16.51 C12.1 | 116.84,44.45 101.6,44.45 | 101.6,44.45 67.31,44.45 | 67.31,44.45 33.02,44.45 | 33.02,44.45 21.59,44.45 | 36.86,12.7 36.86,12.73 | 33.02,44.45 36.86,48.29 IC2.5 37.18,52.07 C2.1 | 33.02,62.23 36.86,66.07 IC1.5 37.18,69.85 C1.1 | 67.31,62.23 71.15,66.07 IC5.5 71.47,69.85 C5.1 | 67.31,44.45 71.15,48.29 IC6.5 71.47,52.07 C6.1 | 67.31,26.67 71.15,30.51 IC7.5 71.47,34.29 C7.1 | 67.31,8.89 71.15,12.73 IC8.5 71.47,16.51 C8.1 | 101.6,62.23 105.44,66.07 IC9.5 105.76,69.85 C9.1 | 101.6,44.45 105.44,48.29 IC10.5 105.76,52.07 C10.1

### Text on the board
tPlace: OFF | ON | AND | OR | XOR | 1 / / 0 | AND | OR | XOR | 1 / / 0 | NAND | NOR | NOT | 1 / / 0 | NAND | NOR | NOT | 1 / / 0 | Logic Lab